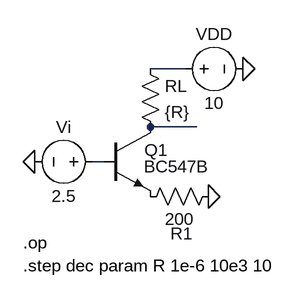
[diagram p0: schematic 2.4.1.charactristics.asc]
2.4.1.charactristics.asc, the LTspice schematic file:
Version 4
SHEET 1 880 680
WIRE 384 128 336 128
WIRE 400 208 336 208
WIRE 272 256 256 256
FLAG 464 128 0
FLAG 176 256 0
FLAG 416 304 0
SYMBOL npn 272 208 R0
WINDOW 3 55 55 Left 2
SYMATTR InstName Q1
SYMATTR Value BC547B
SYMBOL Voltage 368 128 R270
WINDOW 0 32 56 VTop 2
WINDOW 3 -32 56 VBottom 2
SYMATTR InstName VDD
SYMATTR Value 10
SYMBOL Voltage 272 256 R90
WINDOW 0 -32 56 VBottom 2
WINDOW 3 32 56 VTop 2
SYMATTR InstName Vi
SYMATTR Value 2.5
SYMBOL Res 320 112 R0
SYMATTR InstName RL
SYMATTR Value {R}
SYMBOL Res 432 288 R90
WINDOW 0 83 53 VBottom 2
WINDOW 3 32 56 VTop 2
SYMATTR InstName R1
SYMATTR Value 200
TEXT 160 368 Left 2 !.op\n.step dec param R 1e-6 10e3 10

The netlist it stands for:
* 2.4.1.charactristics.asc
Q1 N002 N003 P001 0 BC547B
VDD N001 0 10
Vi N003 0 2.5
RL N001 N002 {R}
R1 0 P001 200
.model NPN NPN
.model PNP PNP
.lib standard.bjt
.op
.step dec param R 1e-6 10e3 10
.backanno
.end